# EAGLE design scoreledboard (EAGLE 7.2.0)
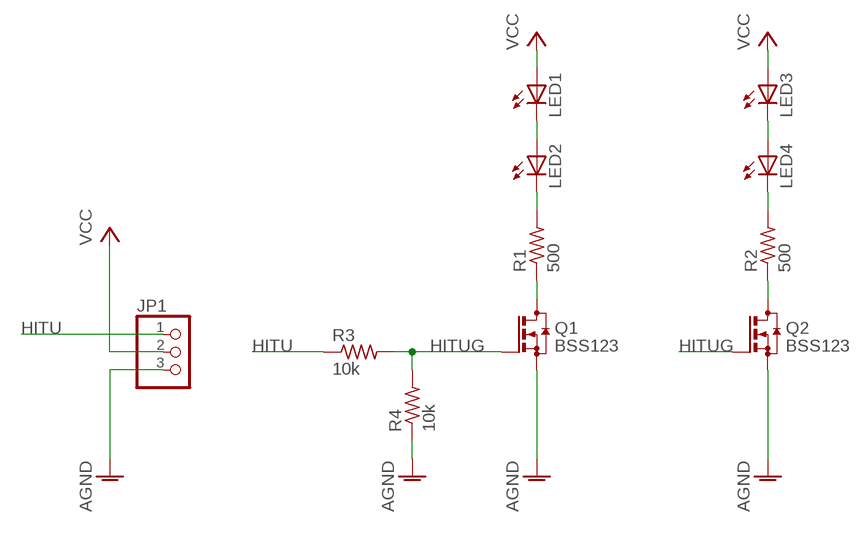
[diagram p0: schematic, sheet 1]

## Parts
JP1  PINHD-1X3  [1X03]
LED1  LEDCHIPLED_1206  [CHIPLED_1206]
LED2  LEDCHIPLED_1206  [CHIPLED_1206]
LED3  LEDCHIPLED_1206  [CHIPLED_1206]
LED4  LEDCHIPLED_1206  [CHIPLED_1206]
Q1  BSS123  [SOT23]
Q2  BSS123  [SOT23]
R1  500  R-US_R1206  [R1206]
R2  500  R-US_R1206  [R1206]
R3  10k  R-US_R1206  [R1206]
R4  10k  R-US_R1206  [R1206]

## Nets
AGND: JP1.3 Q1.2(S) Q2.2(S) R4.1
HITU: JP1.1 R3.1
HITUG: Q1.1(G) Q2.1(G) R3.2 R4.2
N$1: LED1.C LED2.A
N$2: LED2.C R1.2
N$3: Q1.3(D) R1.1
N$4: LED3.C LED4.A
N$5: LED4.C R2.2
N$6: Q2.3(D) R2.1
VCC: JP1.2 LED1.A LED3.A

## Library data of the parts
JP1 = adafruit:PINHD-1X3: PIN HEADER
LED1-LED4 = adafruit:LED: LED OSRAM: - CHIPLED LG R971, LG N971, LY N971, LG Q971, LY Q971, LO R971, LY R971 LH N974, LH R974 LS Q976, LO Q976, LY Q976 LO Q996 - Hyper CHIPLED LW Q18S LB Q993, LB Q99A, LB R99A - SideLED LS A670, LO A670, LY A670, LG A670, LP A670 LB A673, LV A673, LT A673, LW A673 LH A674 LY A675 LS A676, LA A676, LO A676, LY A676, LW A676 LS A679, LY A679, LG A679 - Hyper Micro SIDELED® LS Y876, LA Y876, LO Y876, LY Y876 LT Y87S - SmartLED LW L88C, LW L88S LB L89C, LB L89S, LG L890 LS L89K, LO L89K, LY L89K LS L896, LA L896, LO L896, LY L896 - TOPLED LS T670, LO T670, LY T670, LG T670, LP T670 LSG T670, LSP T670, LSY T670, LOP T670, LYG T670 LG T671, LOG T671, LSG T671 LB T673, LV T673, LT T673, LW T673 LH T674 LS T676, LA T676, LO T676, LY T676, LB T676, LH T676, LSB T676, LW T676 LB T67C, LV T67C, LT T67C, LS T67K, LO T67K, LY T67K, LW E67C LS E67B, LA E67B, LO E67B, LY E67B, LB E67C, LV E67C, LT E67C LW T67C LS T679, LY T679, LG T679 LS T770, LO T770, LY T770, LG T770, LP T770 LB T773, LV T773, LT T773, LW T773 LH T774 LS E675, LA E675, LY E675, LS T675 LS T776, LA T776, LO T776, LY T776, LB T776 LHGB T686 LT T68C, LB T68C - Hyper Mini TOPLED® LB M676 - Mini TOPLED Santana® LG M470 LS M47K, LO M47K, LY M47K Source: http://www.osram.convergy.de/
Q1 Q2 = transistor-small-signal:BSS123: N-CHANNEL MOS FET
R1-R4 = rcl:R-US_: RESISTOR, American symbol

## Board
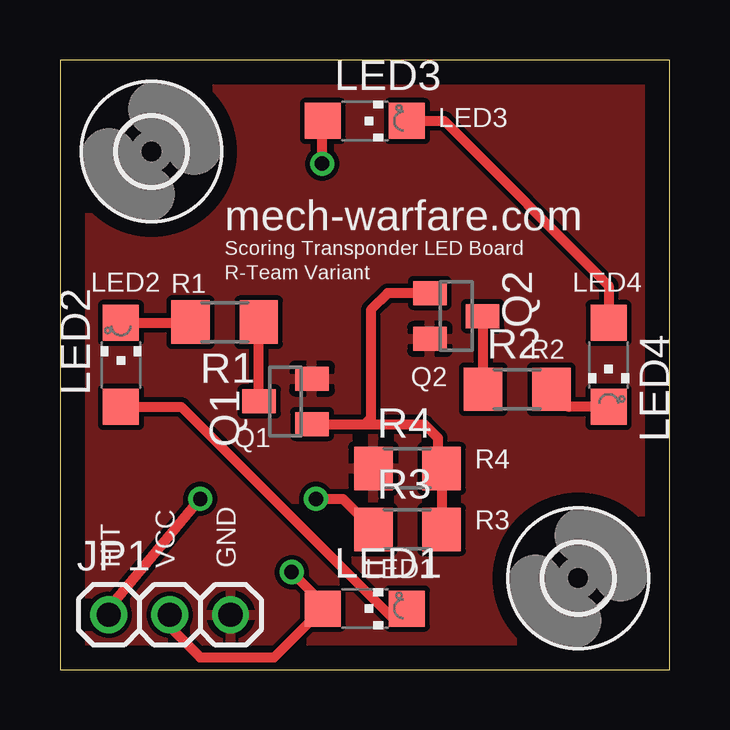
[diagram p1: board, top side]
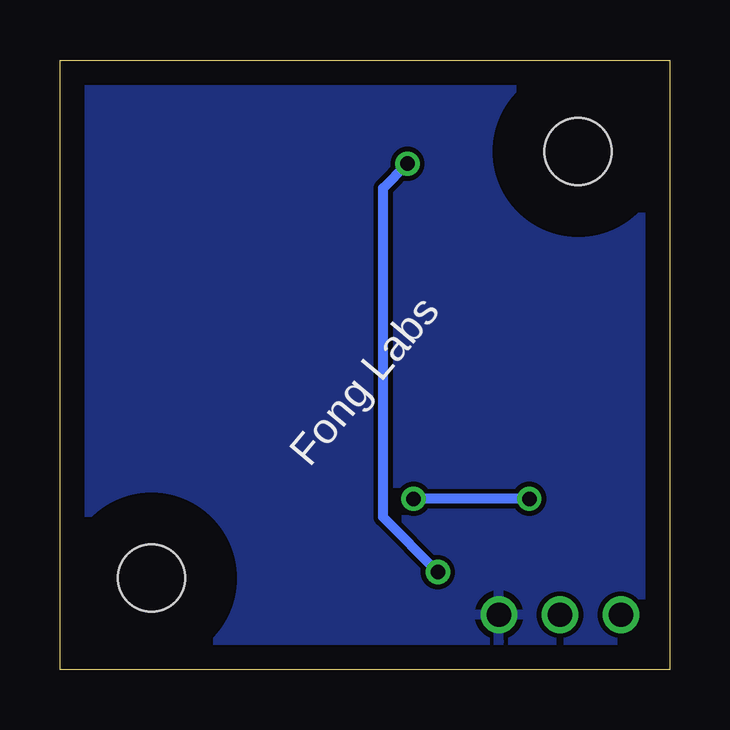
[diagram p2: board, bottom side, seen from below]

Size 25.4 x 25.4 mm. Coordinates in mm from the lower left corner, seen from the top.
Outline: 0,0 25.4,0 25.4,25.4 0,25.4 0,0
Copper layers (1*16): Top 0.035mm / dielectric 1.5mm / Bottom 0.035mm
Design rules "default": minimum track width 10mil, minimum drill 24mil, track to track 8mil, track to pad 8mil, pad to pad 8mil, via to via 8mil, smd to smd 8mil, copper to edge 40mil, drill to drill 8mil, minimum pad ring 10mil, minimum via ring 8mil, stop-mask expansion 4mil, vias tented up to drill 0mil, thermal gap 10mil

### Footprints (pad centres in the part's own frame; a part is rotated, then mirrored left to right if it is on the bottom)
1X03 = drill 1.016: 1 -2.54,0; 2 0,0; 3 2.54,0
CHIPLED_1206 = smd 1.5 x 1.5: A 0,-1.75; C 0,1.75
SOT23 = smd 1 x 1.4: 1 -0.95,-1.1; 2 0.95,-1.1; 3 0,1.1
R1206 = smd 1.6 x 1.803: 1 -1.422,0; 2 1.422,0
2,8 = hole 2.8: 0,0

### Placement (x,y rotation side)
JP1  4.57,2.29 0 top
LED1  12.7,2.54 270 top
LED2  2.54,12.7 0 top
LED3  12.7,22.86 270 top
LED4  22.86,12.7 180 top
Q1  9.4,11.18 90 top
Q2  16.51,14.73 270 top
R1  6.86,14.48 180 top
R2  19.05,11.68 0 top
R3  14.48,5.84 0 top
R4  14.48,8.38 0 top
U$1  [2,8]  21.59,3.81 0 top
U$2  [2,8]  3.81,21.59 0 top

### Tracks (layer width: path | path; a pad name or v marks a point on that pad's centre or on a via)
AGND
  pour Top: -0.25,0 25.65,0 25.65,25.4 -0.25,25.4
  pour Bottom: 0,0 25.65,0 25.65,25.4 0,25.4
HITU  (via drill 0.6)
  Top 0.406: JP1.1 2.03,2.54 v5.84,7.11 | v10.67,7.11 11.79,7.11 R3.1
  Bottom 0.406: v5.84,7.11 v10.67,7.11
HITUG
  Top 0.406: Q1.1 12.7,10.23 | 12.7,10.23 15.17,10.23 15.75,9.65 15.75,8.53 R4.2 R3.2 | Q2.1 13.65,15.68 12.95,14.99 12.95,10.48 12.7,10.23
N$1
  Top 0.406: LED2.A 5.05,10.95 13.97,2.03 13.97,2.06 LED1.C
N$2
  Top 0.406: LED2.C 5.44,14.45 R1.2
N$3
  Top 0.406: Q1.3 8.28,11.18 R1.1
N$4
  Top 0.406: LED3.C 16,22.86 22.86,16 LED4.A
N$5
  Top 0.406: LED4.C 21.21,10.95 R2.2
N$6
  Top 0.406: R2.1 17.63,14.71 Q2.3
VCC  (via drill 0.6)
  Top 0.406: JP1.2 4.57,1.78 5.84,0.51 8.92,0.51 LED1.A 10.95,2.77 v9.65,4.06 | v10.92,21.08 10.92,22.83 LED3.A
  Bottom 0.406: v9.65,4.06 11.94,6.35 11.94,20.07 v10.92,21.08

### Text on the board
_tsilk: LED3 | mech-warfare.com | R1 | Scoring Transponder LED Board | LED2 | R-Team Variant | LED4 | R2 | Q2 | Q1 | R4 | R3 | HIT | VCC | GND | LED1
_bsilk: Fong Labs